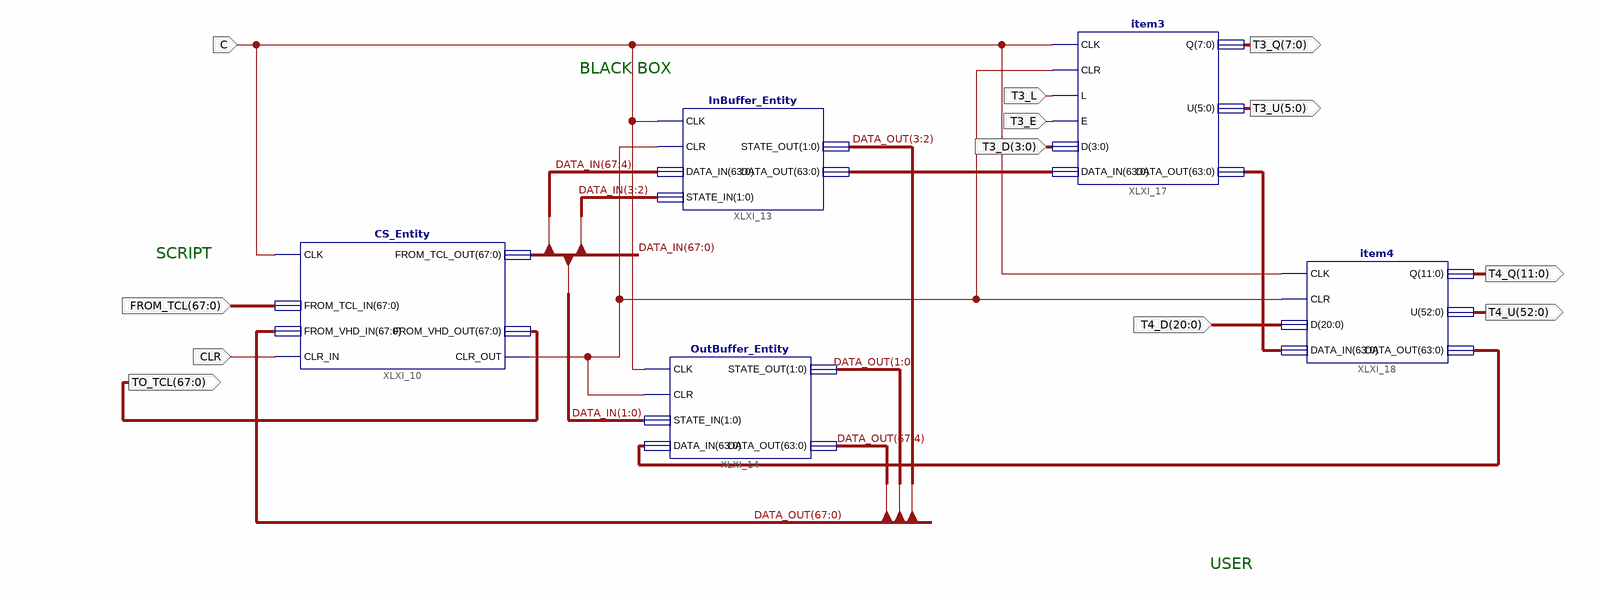
[diagram p0: schematic sheet 1]
// Xilinx ISE schematic top3.sch (spartan6) as structural Verilog: 5 symbols, 12 ports
module top3 (
  input  [67:0] FROM_TCL,
  input  C,
  input  CLR,
  input  T3_L,
  input  T3_E,
  input  [3:0] T3_D,
  input  [20:0] T4_D,
  output [67:0] TO_TCL,
  output [7:0] T3_Q,
  output [5:0] T3_U,
  output [11:0] T4_Q,
  output [52:0] T4_U
);

  wire XLXN_38;
  wire [63:0] XLXN_26, XLXN_27, XLXN_28;
  wire [67:0] DATA_IN, DATA_OUT;

  InBuffer_Entity XLXI_13 (
    .CLK(C), .CLR(XLXN_38), .STATE_IN(DATA_IN[3:2]), .DATA_IN(DATA_IN[67:4]), .STATE_OUT(DATA_OUT[3:2]),
    .DATA_OUT(XLXN_26));
  OutBuffer_Entity XLXI_14 (
    .CLK(C), .CLR(XLXN_38), .STATE_IN(DATA_IN[1:0]), .DATA_IN(XLXN_28), .STATE_OUT(DATA_OUT[1:0]),
    .DATA_OUT(DATA_OUT[67:4]));
  CS_Entity XLXI_10 (
    .CLK(C), .CLR_IN(CLR), .FROM_TCL_IN(FROM_TCL), .FROM_VHD_IN(DATA_OUT), .CLR_OUT(XLXN_38),
    .FROM_TCL_OUT(DATA_IN), .FROM_VHD_OUT(TO_TCL));
  item3 XLXI_17 (
    .CLK(C), .CLR(XLXN_38), .L(T3_L), .E(T3_E), .D(T3_D), .DATA_IN(XLXN_26), .Q(T3_Q), .U(T3_U),
    .DATA_OUT(XLXN_27));
  item4 XLXI_18 (.CLK(C), .CLR(XLXN_38), .D(T4_D), .DATA_IN(XLXN_27), .Q(T4_Q), .U(T4_U), .DATA_OUT(XLXN_28));

  // Notes on the sheet:
  //   BLACK BOX
  //   SCRIPT
  //   USER
endmodule
